# Altium project PowerMonitoringSystem-2.PrjPcb
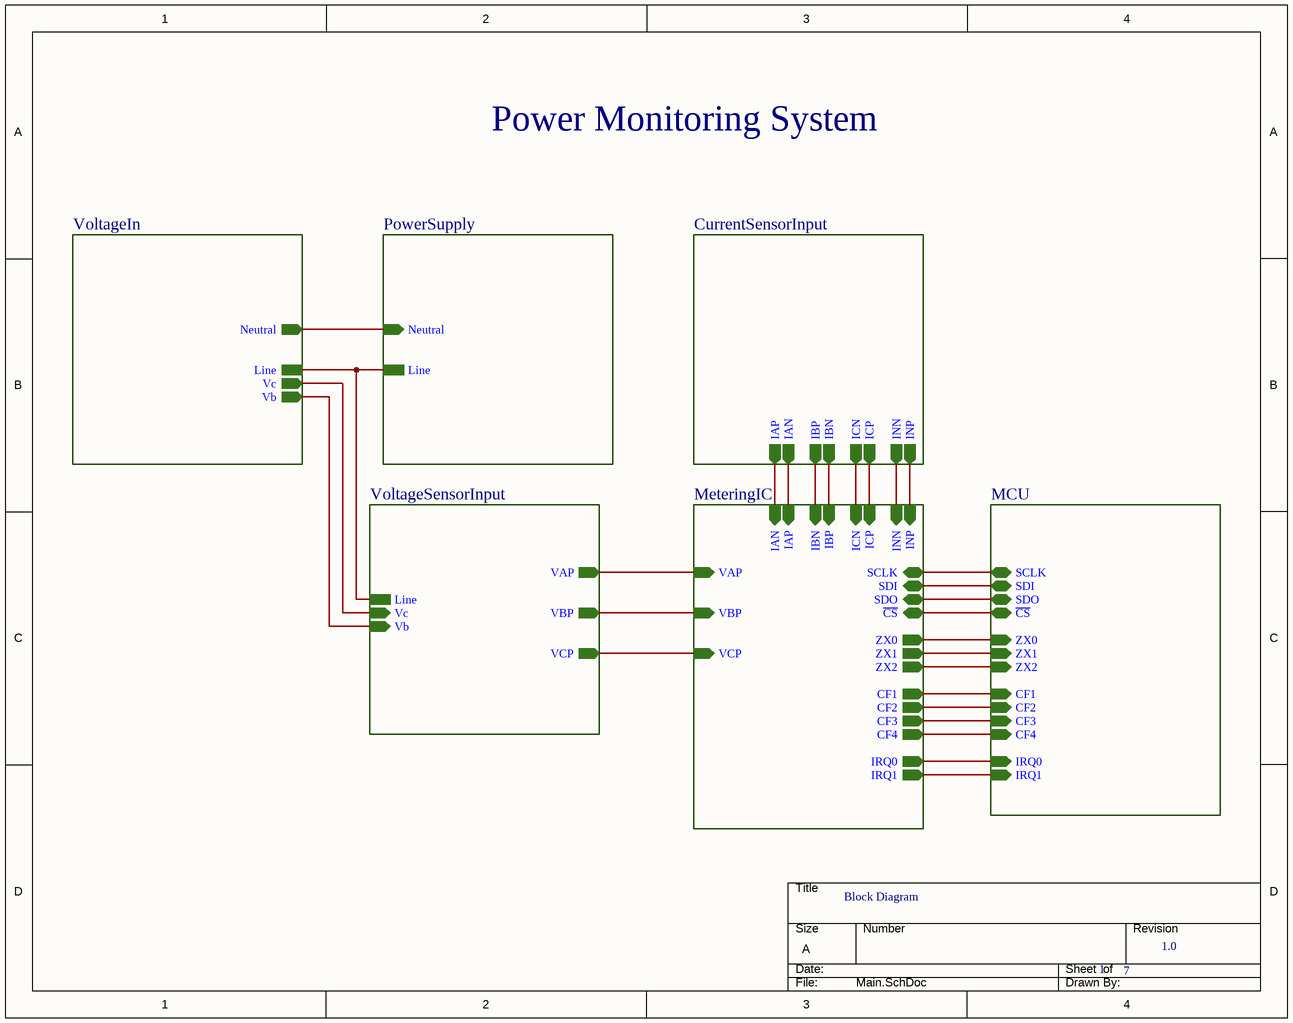
[diagram p0: Main.SchDoc]
7 sheets, 117 parts. Net scope: hierarchical (ports join the sheet entries above them; power ports are global).
Board file: PCB2.PcbDoc
Sheets:
  Main.SchDoc
    VoltageIn = VoltageIn.SchDoc
    PowerSupply = PowerSupply.SchDoc
    CurrentSensorInput = CurrentSensorInput.SchDoc
    MCU = MCU.SchDoc
    VoltageSensorInput = VoltageSensorInput.SchDoc
    MeteringIC = MeteringIC.SchDoc

## Sheet Main.SchDoc
size A; SheetNumber: 1; SheetTotal: 7; ENG_APP_DATE: --/--/--; DSN_APP_DATE: --/--/--; CHK_APP_DATE: --/--/--

### Sub-sheets
CurrentSensorInput = CurrentSensorInput.SchDoc: IAP (out), IAN (out), IBP (out), IBN (out), INP (out), INN (out), ICN (out), ICP (out)
MCU = MCU.SchDoc: SCLK (bidir), SDI (bidir), SDO (bidir), ~{CS} (bidir), ZX0 (in), ZX1 (in), ZX2 (in), CF1 (in), CF2 (in), CF3 (in), CF4 (in), IRQ0 (in), IRQ1 (in)
MeteringIC = MeteringIC.SchDoc: IAN (in), IAP (in), IBN (in), IBP (in), ICN (in), ICP (in), INN (in), INP (in), VAP (in), VBP (in), VCP (in), SDI (bidir), SCLK (bidir), SDO (bidir), ~{CS} (bidir), ZX0 (out), ZX1 (out), ZX2 (out), CF1 (out), CF2 (out), CF3 (out), CF4 (out), IRQ0 (out), IRQ1 (out)
PowerSupply = PowerSupply.SchDoc: Line, Neutral (in)
VoltageIn = VoltageIn.SchDoc: Neutral (out), Line, Vb (out), Vc (out)
VoltageSensorInput = VoltageSensorInput.SchDoc: VAP (out), VBP (out), VCP (out), Line, Vb (in), Vc (in)

### Nets
~{CS}: sheet MCU/~{CS}, sheet MeteringIC/~{CS}
CF1: sheet MCU/CF1, sheet MeteringIC/CF1
CF2: sheet MCU/CF2, sheet MeteringIC/CF2
CF3: sheet MCU/CF3, sheet MeteringIC/CF3
CF4: sheet MCU/CF4, sheet MeteringIC/CF4
IRQ0: sheet MCU/IRQ0, sheet MeteringIC/IRQ0
IRQ1: sheet MCU/IRQ1, sheet MeteringIC/IRQ1
SCLK: sheet MCU/SCLK, sheet MeteringIC/SCLK
SDI: sheet MCU/SDI, sheet MeteringIC/SDI
SDO: sheet MCU/SDO, sheet MeteringIC/SDO
Va: sheet VoltageIn/Line, sheet PowerSupply/Line, sheet VoltageSensorInput/Line
Vb: sheet VoltageIn/Vb, sheet VoltageSensorInput/Vb
Vc: sheet VoltageIn/Vc, sheet VoltageSensorInput/Vc
Vn: sheet VoltageIn/Neutral, sheet PowerSupply/Neutral
ZX0: sheet MCU/ZX0, sheet MeteringIC/ZX0
ZX1: sheet MCU/ZX1, sheet MeteringIC/ZX1
ZX2: sheet MCU/ZX2, sheet MeteringIC/ZX2
NetC11_1: sheet CurrentSensorInput/INN, sheet MeteringIC/INN
NetC12_1: sheet CurrentSensorInput/IBP, sheet MeteringIC/IBN
NetC13_2: sheet CurrentSensorInput/IBN, sheet MeteringIC/IBP
NetC14_2: sheet CurrentSensorInput/INP, sheet MeteringIC/INP
NetC15_1: sheet CurrentSensorInput/ICP, sheet MeteringIC/ICP
NetC16_1: sheet CurrentSensorInput/IAN, sheet MeteringIC/IAP
NetC17_2: sheet CurrentSensorInput/ICN, sheet MeteringIC/ICN
NetC18_2: sheet CurrentSensorInput/IAP, sheet MeteringIC/IAN
NetC19_1: sheet VoltageSensorInput/VAP, sheet MeteringIC/VAP
NetC20_1: sheet VoltageSensorInput/VBP, sheet MeteringIC/VBP
NetC21_1: sheet VoltageSensorInput/VCP, sheet MeteringIC/VCP

### Notes on the sheet
- Power Monitoring System
- Block Diagram
- 1
- 7
- 1.0
- DWG. NO.
- REV.
- SHT.
- THIS DOCUMENT AND THE DATA DISCLOSED HEREIN OR HEREWITH IS THE PROPERTY OF ALTIUM LIMITED AND MAY BE FREELY DISTRIBUTED IN WHOLE. NO RIGHTS ARE RESERVED OR EXPRESS OR IMPLIED WARANTEE GIVEN.
- REVISION
- DESCRIPTION
- DATE
- APPROVED
- ENG:
- APPROVALS
- PROJECT
- DSN:
- CHK:
- REFERENCE DOCUMENTS
- PROJECT REVISION:
- TITLE
- DOCUMENT REVISION:
- DESIGN ITEM:
- BOM:
- FAB DWG:
- PCB DWG:
- ASSY DWG:
- SCALE:
- SIZE
- B
- CAGE CODE
- FILE NAME
- DWG NO.
- SHEET
- OF
- REV

## Sheet VoltageIn.SchDoc
size 199 x 149 mm; SheetNumber: 2; SheetTotal: 7
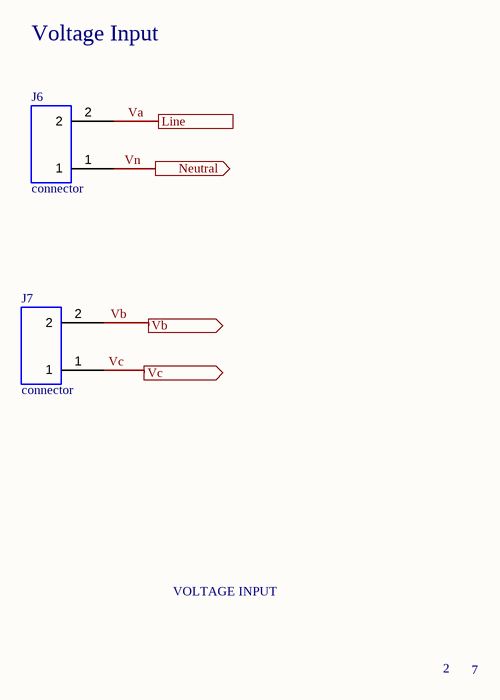
[diagram p1: VoltageIn.SchDoc]

### Parts
J6  connector  [terminal block]
J7  connector  [terminal block]

### Ports
Line (see Main[4C], PowerSupply[4C], VoltageSensorInput[7E]), Neutral (out, see Main[4C], PowerSupply[4C]), Vb (out, see Main[4C], VoltageSensorInput[7D]), Vc (out, see Main[4C], VoltageSensorInput[7B])

### Nets
Va: J6.2 ; port Line
Vb: J7.2 ; port Vb
Vc: J7.1 ; port Vc
Vn: J6.1 ; port Neutral

### Notes on the sheet
- Voltage Input
- VOLTAGE INPUT
- 2
- 7
- DWG. NO.
- REV.
- SHT.
- THIS DOCUMENT AND THE DATA DISCLOSED HEREIN OR HEREWITH IS THE PROPERTY OF ALTIUM LIMITED AND MAY BE FREELY DISTRIBUTED IN WHOLE. NO RIGHTS ARE RESERVED OR EXPRESS OR IMPLIED WARANTEE GIVEN.
- REVISION
- DESCRIPTION
- DATE
- APPROVED
- ENG:
- APPROVALS
- PROJECT
- DSN:
- CHK:
- REFERENCE DOCUMENTS
- PROJECT REVISION:
- TITLE
- DOCUMENT REVISION:
- DESIGN ITEM:
- BOM:
- FAB DWG:
- PCB DWG:
- ASSY DWG:
- SCALE:
- SIZE
- B
- CAGE CODE
- FILE NAME
- DWG NO.
- SHEET
- OF
- REV

## Sheet PowerSupply.SchDoc: Power Supply Unit
size A; SheetNumber: 3; SheetTotal: 7
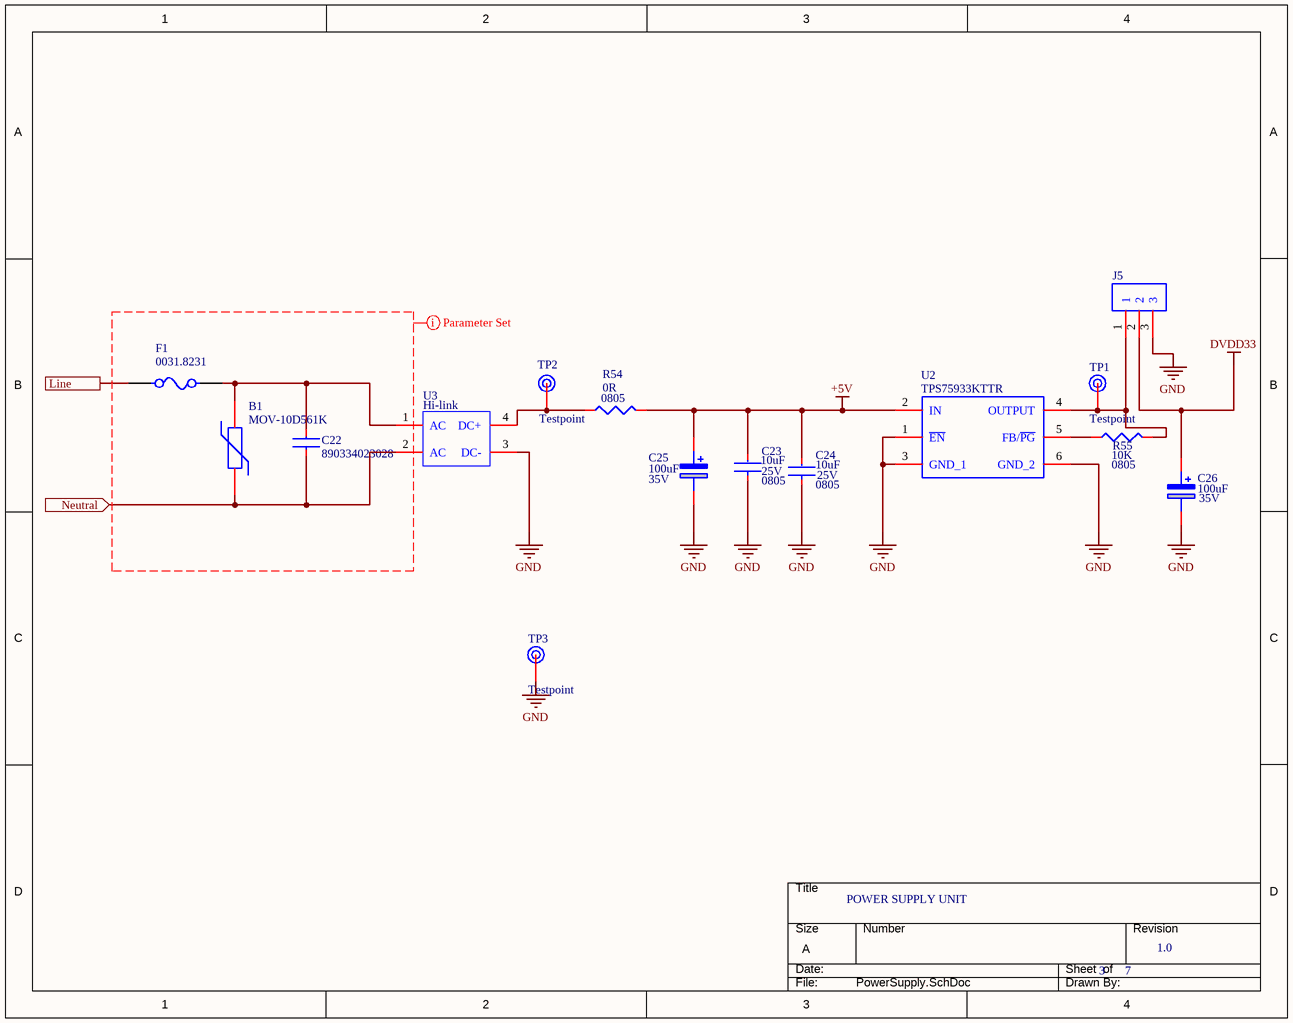
[diagram p2: PowerSupply.SchDoc]

### Parts
B1  MOV-10D561K  [MOV10D561K]
C22  890334023028  [890334023028]
C23  Capacitance: 10uF  Voltage: 25V  Size: 0805  [FP-GRM21B-0_2-e0_2_0_7-IPC_B]  (hidden comment: GRM21BC71E106KE01L)
C24  Capacitance: 10uF  Voltage: 25V  Size: 0805  [FP-GRM21B-0_2-e0_2_0_7-IPC_B]  (hidden comment: GRM21BC71E106KE01L)
C25  Capacitance: 100uF  Voltage: 35V  [CAPPRD250W50D630H1250]  (hidden comment: ESC107M035AE3AA)
C26  Capacitance: 100uF  Voltage: 35V  [CAPPRD250W50D630H1250]  (hidden comment: ESC107M035AE3AA)
F1  0031.8231  [FP-0031_8231-MFG]
J5  HTSW-103-07-G-S  [HDRV3W64P0X254_1X3_749X249X858P]  (value not drawn)
R54  Resistance: 0R  Size: 0805  [RESC2013X84N]  (hidden comment: WSL080500000ZEA9)
R55  Resistance: 10K  Size: 0805  [RESC2013X84N]  (hidden comment: CRCW201010K0JNEFIF)
TP1  Testpoint  [Testpad]
TP2  Testpoint  [Testpad]
TP3  Testpoint  [Testpad]
U2  TPS75933KTTR  [TPS75933KTTR]
U3  Hi-link  [Hi-Link]

### Ports
Line (see Main[3C], VoltageIn[4E], VoltageSensorInput[7E]), Neutral (in, see Main[3C], VoltageIn[4D])

### Nets
+5V: C23.2 C24.2 C25.1(+) R54.1 U2.2(IN)
DVDD33: C26.1(+) J5.2  [project net AVDD33]
GND: C23.1 C24.1 C25.2(-) C26.2(-) J5.3 TP3.1 U2.1(~{EN}) U2.3(GND_1) U2.6(GND_2) U3.3(DC-)
Va: F1.1 ; port Line
Vn: B1.1 C22.1 U3.2(AC) ; port Neutral
NetB1_2: B1.2 C22.2 F1.2 U3.1(AC)
NetJ5_1: J5.1 R55.1 TP1.1 U2.4(OUTPUT)
NetR54_2: R54.2 TP2.1 U3.4(DC+)
NetR55_2: R55.2 U2.5(FB/~{PG})

### Layout directives
net class AC_Nets: (no net found under the mark)

### Notes on the sheet
- POWER SUPPLY UNIT
- 3
- 7
- 1.0

### Library data of the parts
B1 = MOV-10D561K: Varistors 180pF 560volts 10%; Manufacturer_Name: Bourns; Geometry.Height: 15.5mm; Mouser Part Number: 652-MOV-10D561K; Mouser Price/Stock: https://www.mouser.co.uk/ProductDetail/Bourns/MOV-10D561K?qs=lgttKnAd%252B2ArrqGQgWwr6w%3D%3D; Manufacturer_Part_Number: MOV-10D561K; Datasheet Link: https://www.bourns.com/docs/Product-Datasheets/MOV10D.pdf
C22 = 890334023028: WURTH ELEKTRONIK - 890334023028 - Safety Capacitor, 0.22 F, X2, WCAP-FTXX Series, 310 V, Metallized PP; Geometry.Height: 14.5mm; Mouser Part Number: 710-890334023028; Mouser Price/Stock: https://www.mouser.co.uk/ProductDetail/Wurth-Elektronik/890334023028?qs=pceeu5JH%2FH%2FQtsmowFDNJg%3D%3D; Manufacturer_Name: Wurth Elektronik; Manufacturer_Part_Number: 890334023028; Datasheet Link: *
C23 C24 = CMP-06035-063441-1: Chip Multilayer Ceramic Capacitors for General Purpose, 10μF ±10%, X7S(EIA), ±22.0%, 25Vdc, 0805 (2012M)
C25 C26 = ESC107M035AE3AA: ESC, Aluminum, Aluminum Electrolytic, 100 uF, 20%, 35 VDC, -40/+105C, 105C, -40C, 105C, 2,000 Hrs, 12 % , 180 mOhms, 35 uA, 3, 4, 6.3mm, 11mm, Lead Spacing = 2.5mm, 20mm, 10000; Manufacturer_Name: KEMET; Geometry.Height: 12.5mm; Mouser Part Number: 80-ESC107M035AE3AA; Mouser Price/Stock: https://www.mouser.co.uk/ProductDetail/KEMET/ESC107M035AE3AA?qs=F5EMLAvA7IA7q%2FLtm4zOMg%3D%3D; Manufacturer_Part_Number: ESC107M035AE3AA; Datasheet Link: https://content.kemet.com/datasheets/KEM_A4006_ESC.pdf
F1 = CMP-26292-000005-1: FUSE BLOK CARTRIDGE 600V 16A PCB; Manufacturer: Schurter; Voltage Rating Ac: 500V; Number Of Fuses: 1; Standoff Height: 0.7mm; Conn Orientation: Horizontal; ComponentLink2URL: https://www.schurter.com/en/datasheet/typ_OGD.pdf; Voltage Rating Dc: 600V; Package: 0; Device Class L3: unset; Digikey Description: FUSE BLOK CARTRIDGE 600V 16A PCB; Mouser Description: Fuse Holder OGD FUSEHOLDER 5X20/6.3X32; Category: Fuse; Device Class L2: Fuse Holders; Height: 12.7mm; ComponentLink2Description: Datasheet; Ambient Temperature Range Low: -40°C; Ambient Temperature Range High: +85°C; Octopart: https://octopart.com/0031.8231-schurter-8659; Automotive: No; RoHS: TRUE; Fuse Current: 16A; Lead Free: Yes; Device Class L1: Circuit Protection; Manufacturer Part Number: 0031.8231
J5 = HTSW-103-07-G-S: Samtec HTSW, 2.54mm Pitch, 3 Way, 1 Row, Vertical Pin Header, Through Hole; Geometry.Height: 8.58mm; Mouser Part Number: 200-HTSW10307GS; Mouser Price/Stock: https://www.mouser.co.uk/ProductDetail/Samtec/HTSW-103-07-G-S?qs=0lQeLiL1qyYZ%252B%2F6nDbu9tg%3D%3D; Manufacturer_Name: SAMTEC; Manufacturer_Part_Number: HTSW-103-07-G-S; Datasheet Link: http://suddendocs.samtec.com/prints/htsw-xxx-xx-xxx-x-xx-xx-xx-mkt.pdf
R54 = WSL080500000ZEA9: VISHAY - WSL080500000ZEA9 - SMD Chip Resistor, Jumper, 0805 [2012 Metric], 0 ohm, WSL-9 Series, Metal Strip; Geometry.Height: 0.838mm; Mouser Part Number: 71-WSL080500000ZEA9; Mouser Price/Stock: https://www.mouser.co.uk/ProductDetail/Vishay-Dale/WSL080500000ZEA9?qs=f1l5vAGoKgsImKS87N8TmQ%3D%3D; Manufacturer_Name: Vishay; Manufacturer_Part_Number: WSL080500000ZEA9; Datasheet Link: https://ad.componentsearchengine.com/Datasheets/2/WSL080500000ZEA9.pdf
R55 = WSL080500000ZEA9: VISHAY - CRCW201010K0JNEFIF - SMD Chip Resistor, Jumper, 0805 [2012 Metric], 10k, WSL-9 Series, Metal Strip; Geometry.Height: 0.838mm; Mouser Part Number: 71-WSL080500000ZEA9; Mouser Price/Stock: https://www.mouser.co.uk/ProductDetail/Vishay-Dale/WSL080500000ZEA9?qs=f1l5vAGoKgsImKS87N8TmQ%3D%3D; Manufacturer_Name: Vishay; Manufacturer_Part_Number: WSL080500000ZEA9; Datasheet Link: https://ad.componentsearchengine.com/Datasheets/2/WSL080500000ZEA9.pdf
U2 = TPS75933KTTR: Fast-Transient Response, 7.5-A, Low-Dropout Voltage Regulators with Power Good; Manufacturer_Name: Texas Instruments; Geometry.Height: 4.83mm; Mouser Part Number: 595-TPS75933KTTR; Mouser Price/Stock: https://www.mouser.co.uk/ProductDetail/Texas-Instruments/TPS75933KTTR?qs=6zVL%252ByCp0mrrB34Pfenz6g%3D%3D; Manufacturer_Part_Number: TPS75933KTTR; Datasheet Link: http://www.ti.com/lit/gpn/tps759
U3 = Hi-link: Hi-Link HLK-20M05 220VAC to 5VDC 20W Step-Down Power Supply Module

## Sheet CurrentSensorInput.SchDoc
size 250 x 199 mm; SheetNumber: 5; SheetTotal: 7; Voltage: 16; ENG_APP_DATE: --/--/--; DSN_APP_DATE: --/--/--; CHK_APP_DATE: --/--/--
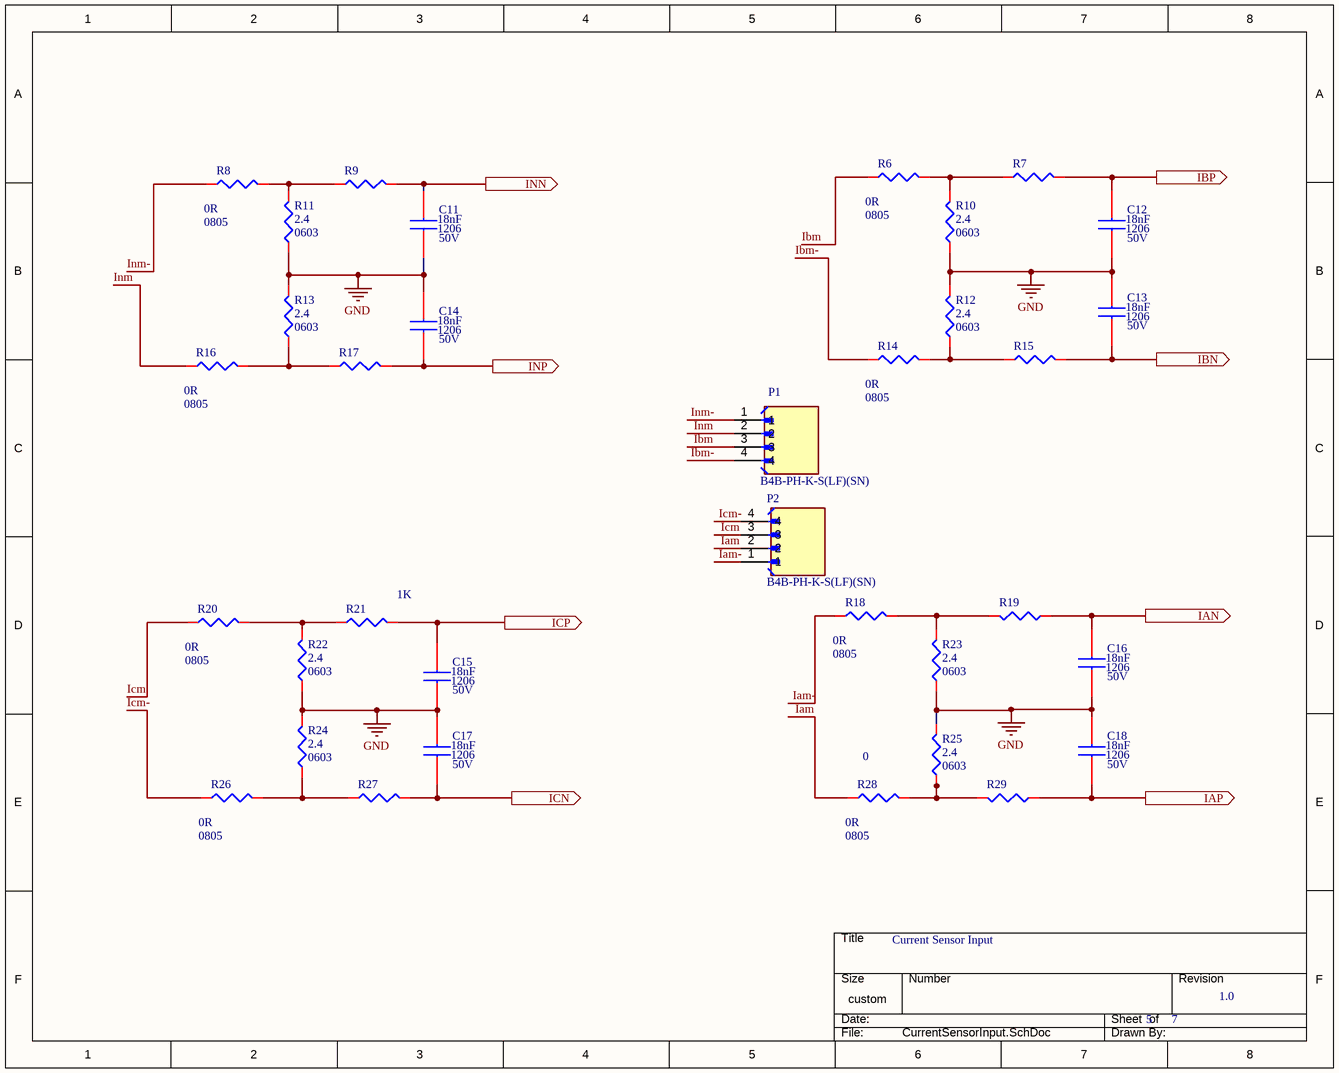
[diagram p3: CurrentSensorInput.SchDoc]

### Parts
C11  Size: 1206  Capacitance: 18nF  Voltage: 50V  [CAPC3316X180N]  (hidden comment: C1206C183J5RACTU)
C12  Size: 1206  Capacitance: 18nF  Voltage: 50V  [CAPC3316X180N]  (hidden comment: C1206C183J5RACTU)
C13  Size: 1206  Capacitance: 18nF  Voltage: 50V  [CAPC3316X180N]  (hidden comment: C1206C183J5RACTU)
C14  Size: 1206  Capacitance: 18nF  Voltage: 50V  [CAPC3316X180N]  (hidden comment: C1206C183J5RACTU)
C15  Size: 1206  Capacitance: 18nF  Voltage: 50V  [CAPC3316X180N]  (hidden comment: C1206C183J5RACTU)
C16  Size: 1206  Capacitance: 18nF  Voltage: 50V  [CAPC3316X180N]  (hidden comment: C1206C183J5RACTU)
C17  Size: 1206  Capacitance: 18nF  Voltage: 50V  [CAPC3316X180N]  (hidden comment: C1206C183J5RACTU)
C18  Size: 1206  Capacitance: 18nF  Voltage: 50V  [CAPC3316X180N]  (hidden comment: C1206C183J5RACTU)
P1  B4B-PH-K-S(LF)(SN)  [JST_B4B-PH-K-S(LF)(SN)]
P2  B4B-PH-K-S(LF)(SN)  [JST_B4B-PH-K-S(LF)(SN)]
R6  Resistance: 0R  Size: 0805  [RESC2013X84N]  (hidden comment: WSL080500000ZEA9)
R7  ERA-6AED102V  [RESC2013X84N]  (value not drawn)
R8  Resistance: 0R  Size: 0805  [RESC2013X84N]  (hidden comment: WSL080500000ZEA9)
R9  ERA-6AED102V  [RESC2013X84N]  (value not drawn)
R10  Resistance: 2.4  Size: 0603  [RESC1608X55N]  (hidden comment: CPF-A-0603B2K4E1)
R11  Resistance: 2.4  Size: 0603  [RESC1608X55N]  (hidden comment: CPF-A-0603B2K4E1)
R12  Resistance: 2.4  Size: 0603  [RESC1608X55N]  (hidden comment: CPF-A-0603B2K4E1)
R13  Resistance: 2.4  Size: 0603  [RESC1608X55N]  (hidden comment: CPF-A-0603B2K4E1)
R14  Resistance: 0R  Size: 0805  [RESC2013X84N]  (hidden comment: WSL080500000ZEA9)
R15  ERA-6AED102V  [RESC2013X84N]  (value not drawn)
R16  Resistance: 0R  Size: 0805  [RESC2013X84N]  (hidden comment: WSL080500000ZEA9)
R17  ERA-6AED102V  [RESC2013X84N]  (value not drawn)
R18  Resistance: 0R  Size: 0805  [RESC2013X84N]  (hidden comment: WSL080500000ZEA9)
R19  ERA-6AED102V  [RESC2013X84N]  (value not drawn)
R20  Resistance: 0R  Size: 0805  [RESC2013X84N]  (hidden comment: WSL080500000ZEA9)
R21  ERA-6AED102V  [RESC2013X84N]  (value not drawn)
R22  Resistance: 2.4  Size: 0603  [RESC1608X55N]  (hidden comment: CPF-A-0603B2K4E1)
R23  Resistance: 2.4  Size: 0603  [RESC1608X55N]  (hidden comment: CPF-A-0603B2K4E1)
R24  Resistance: 2.4  Size: 0603  [RESC1608X55N]  (hidden comment: CPF-A-0603B2K4E1)
R25  Resistance: 2.4  Size: 0603  [RESC1608X55N]  (hidden comment: CPF-A-0603B2K4E1)
R26  Resistance: 0R  Size: 0805  [RESC2013X84N]  (hidden comment: WSL080500000ZEA9)
R27  ERA-6AED102V  [RESC2013X84N]  (value not drawn)
R28  Resistance: 0R  Size: 0805  [RESC2013X84N]  (hidden comment: WSL080500000ZEA9)
R29  ERA-6AED102V  [RESC2013X84N]  (value not drawn)

### Ports
IAN (out, see Main[2C]), IAP (out, see Main[2C]), IBN (out, see Main[2C]), IBP (out, see Main[2C]), ICN (out, see Main[2C], MeteringIC[5D]), ICP (out, see Main[2C], MeteringIC[5D]), INN (out, see Main[2C], MeteringIC[5D]), INP (out, see Main[2C], MeteringIC[5D])

### Nets
GND: C11.2 C12.2 C13.1 C14.1 C15.2 C16.2 C17.1 C18.1 R10.2 R11.2 R12.1 R13.1 R22.2 R23.2 R24.1 R25.1
Iam: P2.2 R28.2
Iam-: P2.1 R18.2
Ibm: P1.3 R6.2
Ibm-: P1.4 R14.2
Icm: P2.3 R20.2
Icm-: P2.4 R26.2
Inm: P1.2 R16.2
Inm-: P1.1 R8.2
NetC11_1: C11.1 R9.1 ; port INN
NetC12_1: C12.1 R7.1 ; port IBP
NetC13_2: C13.2 R15.1 ; port IBN
NetC14_2: C14.2 R17.1 ; port INP
NetC15_1: C15.1 R21.1 ; port ICP
NetC16_1: C16.1 R19.2 ; port IAN
NetC17_2: C17.2 R27.1 ; port ICN
NetC18_2: C18.2 R29.2 ; port IAP
NetR6_1: R6.1 R7.2 R10.1
NetR8_1: R8.1 R9.2 R11.1
NetR12_2: R12.2 R14.1 R15.2
NetR13_2: R13.2 R16.1 R17.2
NetR18_1: R18.1 R19.1 R23.1
NetR20_1: R20.1 R21.2 R22.1
NetR24_2: R24.2 R26.1 R27.2
NetR25_2: R25.2 R28.1 R29.1

### Notes on the sheet
- (near R21) 1K
- (near R28) 0
- Current Sensor Input
- 5
- 7
- 1.0
- DWG. NO.
- REV.
- SHT.
- THIS DOCUMENT AND THE DATA DISCLOSED HEREIN OR HEREWITH IS THE PROPERTY OF ALTIUM LIMITED AND MAY BE FREELY DISTRIBUTED IN WHOLE. NO RIGHTS ARE RESERVED OR EXPRESS OR IMPLIED WARANTEE GIVEN.
- REVISION
- DESCRIPTION
- DATE
- APPROVED
- ENG:
- APPROVALS
- PROJECT
- DSN:
- CHK:
- REFERENCE DOCUMENTS
- PROJECT REVISION:
- TITLE
- DOCUMENT REVISION:
- DESIGN ITEM:
- BOM:
- FAB DWG:
- PCB DWG:
- ASSY DWG:
- SCALE:
- SIZE
- B
- CAGE CODE
- FILE NAME
- DWG NO.
- SHEET
- OF
- REV

### Library data of the parts
C11-C18 = C1206X224KARACAUTO: Multilayer Ceramic Capacitors MLCC - SMD/SMT 50V 0.018uF X7R 1206 5%; Manufacturer_Name: KEMET; Geometry.Height: 1.8mm; Mouser Part Number: 80-C1206X224KARAUTO; Mouser Price/Stock: https://www.mouser.co.uk/ProductDetail/KEMET/C1206X224KARACAUTO?qs=zW32dvEIR3ul9TqTUrs40g%3D%3D; Manufacturer_Part_Number: C1206X224KARACAUTO; Datasheet Link: https://search.kemet.com/component-documentation/download/specsheet/C1206X224KARACAUTO
P1 P2 = CMP-002-00071-1: Connector Header Through Hole 4 position 0.079 (2.00mm); MF: JST; Design Item ID: B4B-PH-K-S(LF)(SN); MP: B4B-PH-K-S(LF)(SN); Pins: 4; SnapEDA_Link: https://www.snapeda.com/parts/B4B-PH-K-S(LF)(SN)/JST/view-part/?ref=snap; Check_prices: https://www.snapeda.com/parts/B4B-PH-K-S(LF)(SN)/JST/view-part/?ref=eda; Component Type: Standard; Case/Package: None; Value: *; Source: B4B-PH-K-S(LF)(SN).SchLib
R6 R8 R14 R16 R18 R20 R26 R28 = WSL080500000ZEA9: as R54 on sheet PowerSupply; Mouser Part Number: 71-WSL080500000ZEA9; Mouser Price/Stock: https://www.mouser.co.uk/ProductDetail/Vishay-Dale/WSL080500000ZEA9?qs=f1l5vAGoKgsImKS87N8TmQ%3D%3D; Manufacturer_Name: Vishay; Manufacturer_Part_Number: WSL080500000ZEA9; Datasheet Link: https://ad.componentsearchengine.com/Datasheets/2/WSL080500000ZEA9.pdf
R7 R9 R15 R17 R19 R21 R27 R29 = ERA-6AED102V: Thin Film Resistors - SMD 0805 1000ohms 25ppm 0.5% AEC-Q200; Manufacturer_Name: Panasonic; Geometry.Height: 0.6mm; Mouser Part Number: 667-ERA-6AED102V; Mouser Price/Stock: https://www.mouser.co.uk/ProductDetail/Panasonic/ERA-6AED102V?qs=MNPzkKEzRtTAvKH%252BuMqwyg%3D%3D; Manufacturer_Part_Number: ERA-6AED102V; Datasheet Link: https://industrial.panasonic.com/cdbs/www-data/pdf/RDM0000/AOA0000C307.pdf
R10-R13 R22-R25 = WSL080500000ZEA9: Thick Film Resistors - SMD 2.4OHM 1% 1/2W 100PPM; Manufacturer_Name: Vishay; Geometry.Height: 0.838mm; Mouser Part Number: 71-WSL080500000ZEA9; Mouser Price/Stock: https://www.mouser.co.uk/ProductDetail/Vishay-Dale/WSL080500000ZEA9?qs=f1l5vAGoKgsImKS87N8TmQ%3D%3D; Manufacturer_Part_Number: WSL080500000ZEA9; Datasheet Link: https://ad.componentsearchengine.com/Datasheets/2/WSL080500000ZEA9.pdf

## Sheet MCU.SchDoc
size 250 x 219 mm; SheetNumber: 7; SheetTotal: 7; ENG_APP_DATE: --/--/--; DSN_APP_DATE: --/--/--; CHK_APP_DATE: --/--/--
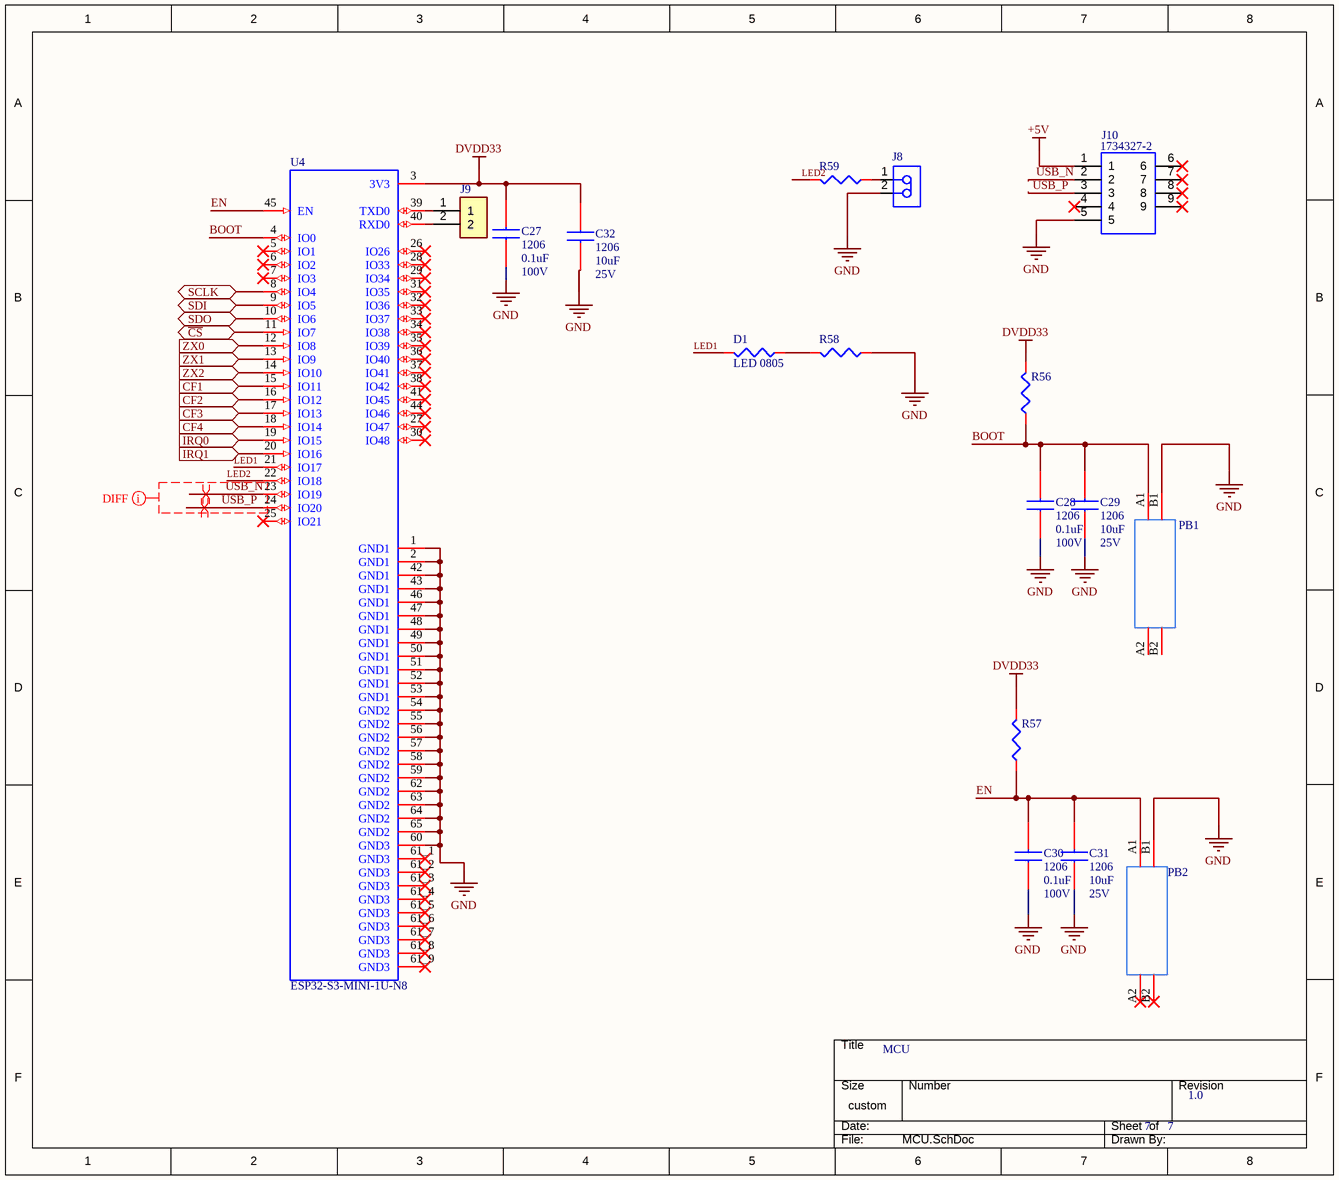
[diagram p4: MCU.SchDoc]

### Parts
C27  Size: 1206  Capacitance: 0.1uF  Voltage: 100V  [CAPC3316X180N]  (hidden comment: C1206C104J1RACAUTO)
C28  Size: 1206  Capacitance: 0.1uF  Voltage: 100V  [CAPC3316X180N]  (hidden comment: C1206C104J1RACAUTO)
C29  Size: 1206  Capacitance: 10uF  Voltage: 25V  [CAPC3316X180N]  (hidden comment: MBAST31LAB7106KTNA01)
C30  Size: 1206  Capacitance: 0.1uF  Voltage: 100V  [CAPC3316X180N]  (hidden comment: C1206C104J1RACAUTO)
C31  Size: 1206  Capacitance: 10uF  Voltage: 25V  [CAPC3316X180N]  (hidden comment: MBAST31LAB7106KTNA01)
C32  Size: 1206  Capacitance: 10uF  Voltage: 25V  [CAPC3316X180N]  (hidden comment: MBAST31LAB7106KTNA01)
D1  LED 0805  [RESC2013X84N]
J8  B2B-PH-K-S(LF)(SN)  [JST-B2B-PH-K-S_V]  (value not drawn)
J9  HTSW-102-07-G-S  [HDRV2W64P0X254_1X2_508X248X838P]  (value not drawn)
J10  1734327-2  [17343272]
PB1  EVP-BV2C3L000  [EVPBV2C3L000]  (value not drawn)
PB2  EVP-BV2C3L000  [EVPBV2C3L000]  (value not drawn)
R56  ERA-6AED102V  [RESC2013X84N]  (value not drawn)
R57  ERA-6AED102V  [RESC2013X84N]  (value not drawn)
R58  ERA-6AED102V  [RESC2013X84N]  (value not drawn)
R59  ERA-6AED102V  [RESC2013X84N]  (value not drawn)
U4  ESP32-S3-MINI-1U-N8  [XCVR_ESP32-S3-MINI-1U-N8]

### Ports
CF1 (in, see Main[1B], MeteringIC[1D]), CF2 (in, see Main[1B], MeteringIC[2C]), CF3 (in, see Main[1B], MeteringIC[2C]), CF4 (in, see Main[1B], MeteringIC[2C]), IRQ0 (in, see Main[1B], MeteringIC[2C]), IRQ1 (in, see Main[1A], MeteringIC[2C]), SCLK (bidir, see Main[1B], MeteringIC[2E]), SDI (bidir, see Main[1B], MeteringIC[2E]), SDO (bidir, see Main[1B], MeteringIC[2E]), ZX0 (in, see Main[1B], MeteringIC[2D]), ZX1 (in, see Main[1B], MeteringIC[2D]), ZX2 (in, see Main[1B], MeteringIC[2D]), ~{CS} (bidir, see Main[1B], MeteringIC[2E])

### Nets
+5V: J10.1
DVDD33: C27.1 C32.1 R56.1 R57.1 U4.3(3V3)  [project net AVDD33]
GND: C27.2 C28.2 C29.2 C30.2 C31.2 C32.2 J8.2 J10.5 PB1.B1(NO_1) PB2.B1(NO_1) R58.2 U4.1(GND1) U4.2(GND1) U4.42(GND1) U4.43(GND1) U4.46(GND1) U4.47(GND1) U4.48(GND1) U4.49(GND1) U4.50(GND1) U4.51(GND1) U4.52(GND1) U4.53(GND1) U4.54(GND2) U4.55(GND2) U4.56(GND2) U4.57(GND2) U4.58(GND2) U4.59(GND2) U4.60(GND3) U4.62(GND2) U4.63(GND2) U4.64(GND2) U4.65(GND2)
BOOT: C28.1 C29.1 PB1.A1(COM_1) R56.2 U4.4(IO0)
~{CS}: U4.11(IO7) ; port ~{CS}
CF1: U4.15(IO11) ; port CF1
CF2: U4.16(IO12) ; port CF2
CF3: U4.17(IO13) ; port CF3
CF4: U4.18(IO14) ; port CF4
EN: C30.1 C31.1 PB2.A1(COM_1) R57.2 U4.45(EN)
IRQ0: U4.19(IO15) ; port IRQ0
IRQ1: U4.20(IO16) ; port IRQ1
LED1: D1.1 U4.21(IO17)
LED2: R59.2 U4.22(IO18)
SCLK: U4.8(IO4) ; port SCLK
SDI: U4.9(IO5) ; port SDI
SDO: U4.10(IO6) ; port SDO
USB_N: J10.2 U4.23(IO19)
USB_P: J10.3 U4.24(IO20)
ZX0: U4.12(IO8) ; port ZX0
ZX1: U4.13(IO9) ; port ZX1
ZX2: U4.14(IO10) ; port ZX2
NetD1_2: D1.2 R58.1
NetJ8_1: J8.1 R59.1
NetJ9_1: J9.1 U4.39(TXD0)
NetJ9_2: J9.2 U4.40(RXD0)

Not connected (* = marked no-connect by the designer): J10 4* 6* 7* 8* 9*; PB1 A2(COM_2) B2(NO_2); PB2 A2(COM_2)* B2(NO_2)*; U4 5(IO1)* 6(IO2)* 7(IO3)* 25(IO21)* 26(IO26)* 27(IO47)* 28(IO33)* 29(IO34)* 30(IO48)* 31(IO35)* 32(IO36)* 33(IO37)* 34(IO38)* 35(IO39)* 36(IO40)* 37(IO41)* 38(IO42)* 41(IO45)* 44(IO46)* 61_1(GND3)* 61_2(GND3)* 61_3(GND3)* 61_4(GND3)* 61_5(GND3)* 61_6(GND3)* 61_7(GND3)* 61_8(GND3)* 61_9(GND3)*

### Layout directives
differential pair: USB_N, USB_P
net class DIFF: USB_N, USB_P

### Notes on the sheet
- MCU
- 7
- 1.0
- DWG. NO.
- REV.
- SHT.
- THIS DOCUMENT AND THE DATA DISCLOSED HEREIN OR HEREWITH IS THE PROPERTY OF ALTIUM LIMITED AND MAY BE FREELY DISTRIBUTED IN WHOLE. NO RIGHTS ARE RESERVED OR EXPRESS OR IMPLIED WARANTEE GIVEN.
- REVISION
- DESCRIPTION
- DATE
- APPROVED
- ENG:
- APPROVALS
- PROJECT
- DSN:
- CHK:
- REFERENCE DOCUMENTS
- PROJECT REVISION:
- TITLE
- DOCUMENT REVISION:
- DESIGN ITEM:
- BOM:
- FAB DWG:
- PCB DWG:
- ASSY DWG:
- SCALE:
- SIZE
- B
- CAGE CODE
- FILE NAME
- DWG NO.
- SHEET
- OF
- REV

### Library data of the parts
C27 C28 C30 = C1206X224KARACAUTO: Multilayer Ceramic Capacitors MLCC - SMD/SMT 100V 0.1uF X7R 1206 5% AEC-Q200; Manufacturer_Name: KEMET; Geometry.Height: 1.8mm; Mouser Part Number: 80-C1206X224KARAUTO; Mouser Price/Stock: https://www.mouser.co.uk/ProductDetail/KEMET/C1206X224KARACAUTO?qs=zW32dvEIR3ul9TqTUrs40g%3D%3D; Manufacturer_Part_Number: C1206X224KARACAUTO; Datasheet Link: https://search.kemet.com/component-documentation/download/specsheet/C1206X224KARACAUTO
C29 C31 C32 = C1206X224KARACAUTO: Multilayer Ceramic Capacitors MLCC - SMD/SMT 25V 10uF X7R 1206 10%; Manufacturer_Name: KEMET; Geometry.Height: 1.8mm; Mouser Part Number: 80-C1206X224KARAUTO; Mouser Price/Stock: https://www.mouser.co.uk/ProductDetail/KEMET/C1206X224KARACAUTO?qs=zW32dvEIR3ul9TqTUrs40g%3D%3D; Manufacturer_Part_Number: C1206X224KARACAUTO; Datasheet Link: https://search.kemet.com/component-documentation/download/specsheet/C1206X224KARACAUTO
D1 R56 R57 = ERA-6AED102V: as R7 on sheet CurrentSensorInput; Datasheet Link: https://industrial.panasonic.com/cdbs/www-data/pdf/RDM0000/AOA0000C307.pdf; Manufacturer_Part_Number: ERA-6AED102V; Mouser Part Number: 667-ERA-6AED102V; Mouser Price/Stock: https://www.mouser.co.uk/ProductDetail/Panasonic/ERA-6AED102V?qs=MNPzkKEzRtTAvKH%252BuMqwyg%3D%3D
J8 = CMP-2000-05162-1: Male Header, Pitch 2 mm, 1 x 2 Position, Height 6 mm, Tail Length 3.4 mm, -25 to 85 degC, RoHS, Bulk; Manufacturer: JST; Pitch: 2mm; Style/Orientation: StraightHeader/Plug; No of Positions: 2; Datasheet Version: Nov-08; Datasheet URL: http://datasheet.octopart.com/B2B-PH-K-S%28LF%29%28SN%29-JST-datasheet-8324864.pdf; Manufacturer URL: http://www.jst.com/home2.html; Type: ShroudedHeader; Termination: Crimp
J9 = HTSW-102-07-G-S: Samtec, HTSW, 2 Way, 1 Row, Vertical Pin Header; Geometry.Height: 8.38mm; Mouser Part Number: 200-HTSW10207GS; Mouser Price/Stock: https://www.mouser.co.uk/ProductDetail/Samtec/HTSW-102-07-G-S?qs=FESYatJ8odI1BCBanfu%2FIg%3D%3D; Manufacturer_Name: SAMTEC; Manufacturer_Part_Number: HTSW-102-07-G-S; Datasheet Link: http://suddendocs.samtec.com/prints/htsw-xxx-xx-xxx-x-xx-xx-xx-mkt.pdf
J10 = 1734327-2: Body Features: Offset 0 MM; Manufacturer_Name: TE Connectivity; Geometry.Height: 4.14mm; Mouser Part Number: 571-1734327-2; Mouser Price/Stock: https://www.mouser.co.uk/ProductDetail/TE-Connectivity/1734327-2?qs=MP5IOa7hLjVR6N4sgEE7xA%3D%3D; Manufacturer_Part_Number: 1734327-2; Datasheet Link: https://www.te.com/commerce/DocumentDelivery/DDEController?Action=srchrtrv&DocNm=1734327&DocType=Customer+Drawing&DocLang=English&DocFormat=pdf&PartCntxt=1734327-2
PB1 PB2 = EVP-BV2C3L000: Tactile Switches 6.5mm 6.2mm SMD Op Force 1.6N; Manufacturer_Name: Panasonic; Geometry.Height: 4.5mm; Mouser Part Number: 667-EVP-BV2C3L000; Mouser Price/Stock: https://www.mouser.co.uk/ProductDetail/Panasonic/EVP-BV2C3L000?qs=MyNHzdoqoQLjk3IN4ali%252Bg%3D%3D; Manufacturer_Part_Number: EVP-BV2C3L000; Datasheet Link: https://media.digikey.com/pdf/Data%20Sheets/Panasonic%20Electronic%20Components/EVP-BV_Type_DS.pdf
R58 = ERA-6AED102V: Thin Film Resistors - SMD 0805 330ohms 25ppm 0.5% AEC-Q200; Manufacturer_Name: Panasonic; Geometry.Height: 0.6mm; Datasheet Link: https://industrial.panasonic.com/cdbs/www-data/pdf/RDM0000/AOA0000C307.pdf; Manufacturer_Part_Number: ERA-6AED102V; Mouser Part Number: 667-ERA-6AED102V; Mouser Price/Stock: https://www.mouser.co.uk/ProductDetail/Panasonic/ERA-6AED102V?qs=MNPzkKEzRtTAvKH%252BuMqwyg%3D%3D
R59 = ERA-6AED102V: 0805 330R; Manufacturer_Name: Panasonic; Geometry.Height: 0.6mm; Datasheet Link: https://industrial.panasonic.com/cdbs/www-data/pdf/RDM0000/AOA0000C307.pdf; Manufacturer_Part_Number: ERA-6AED102V; Mouser Part Number: 667-ERA-6AED102V; Mouser Price/Stock: https://www.mouser.co.uk/ProductDetail/Panasonic/ERA-6AED102V?qs=MNPzkKEzRtTAvKH%252BuMqwyg%3D%3D
U4 = ESP32-S3-MINI-1U-N8: Bluetooth, WiFi 802.11b/g/n, Bluetooth v5.0 Transceiver Module 2.4GHz Antenna Not Included, U.FL Surface Mount; MF: Espressif Systems; SnapEDA_Link: https://www.snapeda.com/parts/ESP32-S3-MINI-1U-N8/Espressif+Systems/view-part/?ref=snap; Package: VFQFN-56 Espressif Systems; Value: *; MP: ESP32-S3-MINI-1U-N8; Check_prices: https://www.snapeda.com/parts/ESP32-S3-MINI-1U-N8/Espressif+Systems/view-part/?ref=eda

## Sheet VoltageSensorInput.SchDoc
size 219 x 180 mm; SheetNumber: 6; SheetTotal: 7; ENG_APP_DATE: --/--/--; DSN_APP_DATE: --/--/--; CHK_APP_DATE: --/--/--
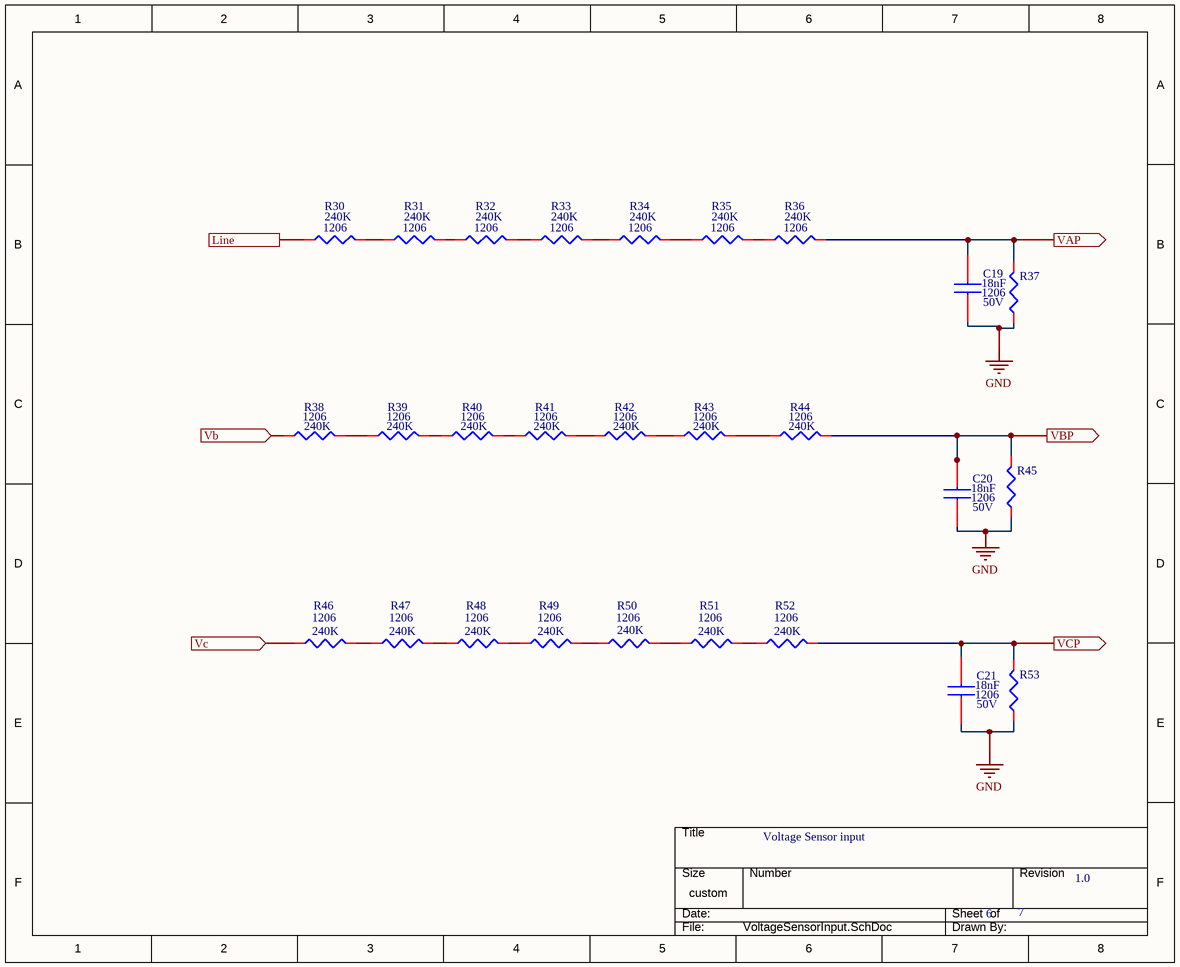
[diagram p5: VoltageSensorInput.SchDoc]

### Parts
C19  Size: 1206  Capacitance: 18nF  Voltage: 50V  [CAPC3316X180N]  (hidden comment: C1206C183J5RACTU)
C20  Size: 1206  Capacitance: 18nF  Voltage: 50V  [CAPC3316X180N]  (hidden comment: C1206C183J5RACTU)
C21  Size: 1206  Capacitance: 18nF  Voltage: 50V  [CAPC3316X180N]  (hidden comment: C1206C183J5RACTU)
R30  Size: 1206  Resistance: 240K  [RESC3216X70N]  (hidden comment: ERA-8AEB244V)
R31  Size: 1206  Resistance: 240K  [RESC3216X70N]  (hidden comment: ERA-8AEB244V)
R32  Size: 1206  Resistance: 240K  [RESC3216X70N]  (hidden comment: ERA-8AEB244V)
R33  Size: 1206  Resistance: 240K  [RESC3216X70N]  (hidden comment: ERA-8AEB244V)
R34  Size: 1206  Resistance: 240K  [RESC3216X70N]  (hidden comment: ERA-8AEB244V)
R35  Size: 1206  Resistance: 240K  [RESC3216X70N]  (hidden comment: ERA-8AEB244V)
R36  Size: 1206  Resistance: 240K  [RESC3216X70N]  (hidden comment: ERA-8AEB244V)
R37  ERA-6AED102V  [RESC2013X84N]  (value not drawn)
R38  Size: 1206  Resistance: 240K  [RESC3216X70N]  (hidden comment: ERA-8AEB244V)
R39  Size: 1206  Resistance: 240K  [RESC3216X70N]  (hidden comment: ERA-8AEB244V)
R40  Size: 1206  Resistance: 240K  [RESC3216X70N]  (hidden comment: ERA-8AEB244V)
R41  Size: 1206  Resistance: 240K  [RESC3216X70N]  (hidden comment: ERA-8AEB244V)
R42  Size: 1206  Resistance: 240K  [RESC3216X70N]  (hidden comment: ERA-8AEB244V)
R43  Size: 1206  Resistance: 240K  [RESC3216X70N]  (hidden comment: ERA-8AEB244V)
R44  Size: 1206  Resistance: 240K  [RESC3216X70N]  (hidden comment: ERA-8AEB244V)
R45  ERA-6AED102V  [RESC2013X84N]  (value not drawn)
R46  Size: 1206  Resistance: 240K  [RESC3216X70N]  (hidden comment: ERA-8AEB244V)
R47  Size: 1206  Resistance: 240K  [RESC3216X70N]  (hidden comment: ERA-8AEB244V)
R48  Size: 1206  Resistance: 240K  [RESC3216X70N]  (hidden comment: ERA-8AEB244V)
R49  Size: 1206  Resistance: 240K  [RESC3216X70N]  (hidden comment: ERA-8AEB244V)
R50  Size: 1206  Resistance: 240K  [RESC3216X70N]  (hidden comment: ERA-8AEB244V)
R51  Size: 1206  Resistance: 240K  [RESC3216X70N]  (hidden comment: ERA-8AEB244V)
R52  Size: 1206  Resistance: 240K  [RESC3216X70N]  (hidden comment: ERA-8AEB244V)
R53  ERA-6AED102V  [RESC2013X84N]  (value not drawn)

### Ports
Line (see Main[3B], PowerSupply[4C], VoltageIn[4E]), VAP (out, see Main[3B], MeteringIC[5C]), Vb (in, see Main[3B], VoltageIn[4C]), VBP (out, see Main[3B], MeteringIC[5C]), Vc (in, see Main[3B], VoltageIn[4C]), VCP (out, see Main[3B], MeteringIC[5D])

### Nets
GND: C19.2 C20.2 C21.2 R37.2 R45.2 R53.2
Va: R30.2 ; port Line
Vb: R38.2 ; port Vb
Vc: R46.2 ; port Vc
NetC19_1: C19.1 R36.1 R37.1 ; port VAP
NetC20_1: C20.1 R44.1 R45.1 ; port VBP
NetC21_1: C21.1 R52.1 R53.1 ; port VCP
NetR30_1: R30.1 R31.2
NetR31_1: R31.1 R32.2
NetR32_1: R32.1 R33.2
NetR33_1: R33.1 R34.2
NetR34_1: R34.1 R35.2
NetR35_1: R35.1 R36.2
NetR38_1: R38.1 R39.2
NetR39_1: R39.1 R40.2
NetR40_1: R40.1 R41.2
NetR41_1: R41.1 R42.2
NetR42_1: R42.1 R43.2
NetR43_1: R43.1 R44.2
NetR46_1: R46.1 R47.2
NetR47_1: R47.1 R48.2
NetR48_1: R48.1 R49.2
NetR49_1: R49.1 R50.2
NetR50_1: R50.1 R51.2
NetR51_1: R51.1 R52.2

### Notes on the sheet
- Voltage Sensor input
- 6
- 7
- 1.0
- DWG. NO.
- REV.
- SHT.
- THIS DOCUMENT AND THE DATA DISCLOSED HEREIN OR HEREWITH IS THE PROPERTY OF ALTIUM LIMITED AND MAY BE FREELY DISTRIBUTED IN WHOLE. NO RIGHTS ARE RESERVED OR EXPRESS OR IMPLIED WARANTEE GIVEN.
- REVISION
- DESCRIPTION
- DATE
- APPROVED
- ENG:
- APPROVALS
- PROJECT
- DSN:
- CHK:
- REFERENCE DOCUMENTS
- PROJECT REVISION:
- TITLE
- DOCUMENT REVISION:
- DESIGN ITEM:
- BOM:
- FAB DWG:
- PCB DWG:
- ASSY DWG:
- SCALE:
- SIZE
- B
- CAGE CODE
- FILE NAME
- DWG NO.
- SHEET
- OF
- REV

### Library data of the parts
C19-C21 = C1206X224KARACAUTO: as C11 on sheet CurrentSensorInput; Mouser Part Number: 80-C1206X224KARAUTO; Mouser Price/Stock: https://www.mouser.co.uk/ProductDetail/KEMET/C1206X224KARACAUTO?qs=zW32dvEIR3ul9TqTUrs40g%3D%3D; Manufacturer_Part_Number: C1206X224KARACAUTO; Datasheet Link: https://search.kemet.com/component-documentation/download/specsheet/C1206X224KARACAUTO
R30-R36 R38-R44 R46-R52 = ERA-8AEB244V: Thin Film Resistors - SMD 1206 240Kohm 0.1% 25ppm; Manufacturer_Name: Panasonic; Geometry.Height: 0.7mm; Mouser Part Number: 667-ERA-8AEB244V; Mouser Price/Stock: https://www.mouser.com/Search/Refine.aspx?Keyword=667-ERA-8AEB244V; Manufacturer_Part_Number: ERA-8AEB244V; Datasheet Link: https://componentsearchengine.com/Datasheets/1/ERA-8AEB244V.pdf
R37 R45 R53 = ERA-6AED102V: as R7 on sheet CurrentSensorInput; Mouser Part Number: 667-ERA-6AED102V; Mouser Price/Stock: https://www.mouser.co.uk/ProductDetail/Panasonic/ERA-6AED102V?qs=MNPzkKEzRtTAvKH%252BuMqwyg%3D%3D; Manufacturer_Part_Number: ERA-6AED102V; Datasheet Link: https://industrial.panasonic.com/cdbs/www-data/pdf/RDM0000/AOA0000C307.pdf

## Sheet MeteringIC.SchDoc
size 299 x 240 mm; SheetNumber: 4; SheetTotal: 7; ENG_APP_DATE: --/--/--; DSN_APP_DATE: --/--/--; CHK_APP_DATE: --/--/--
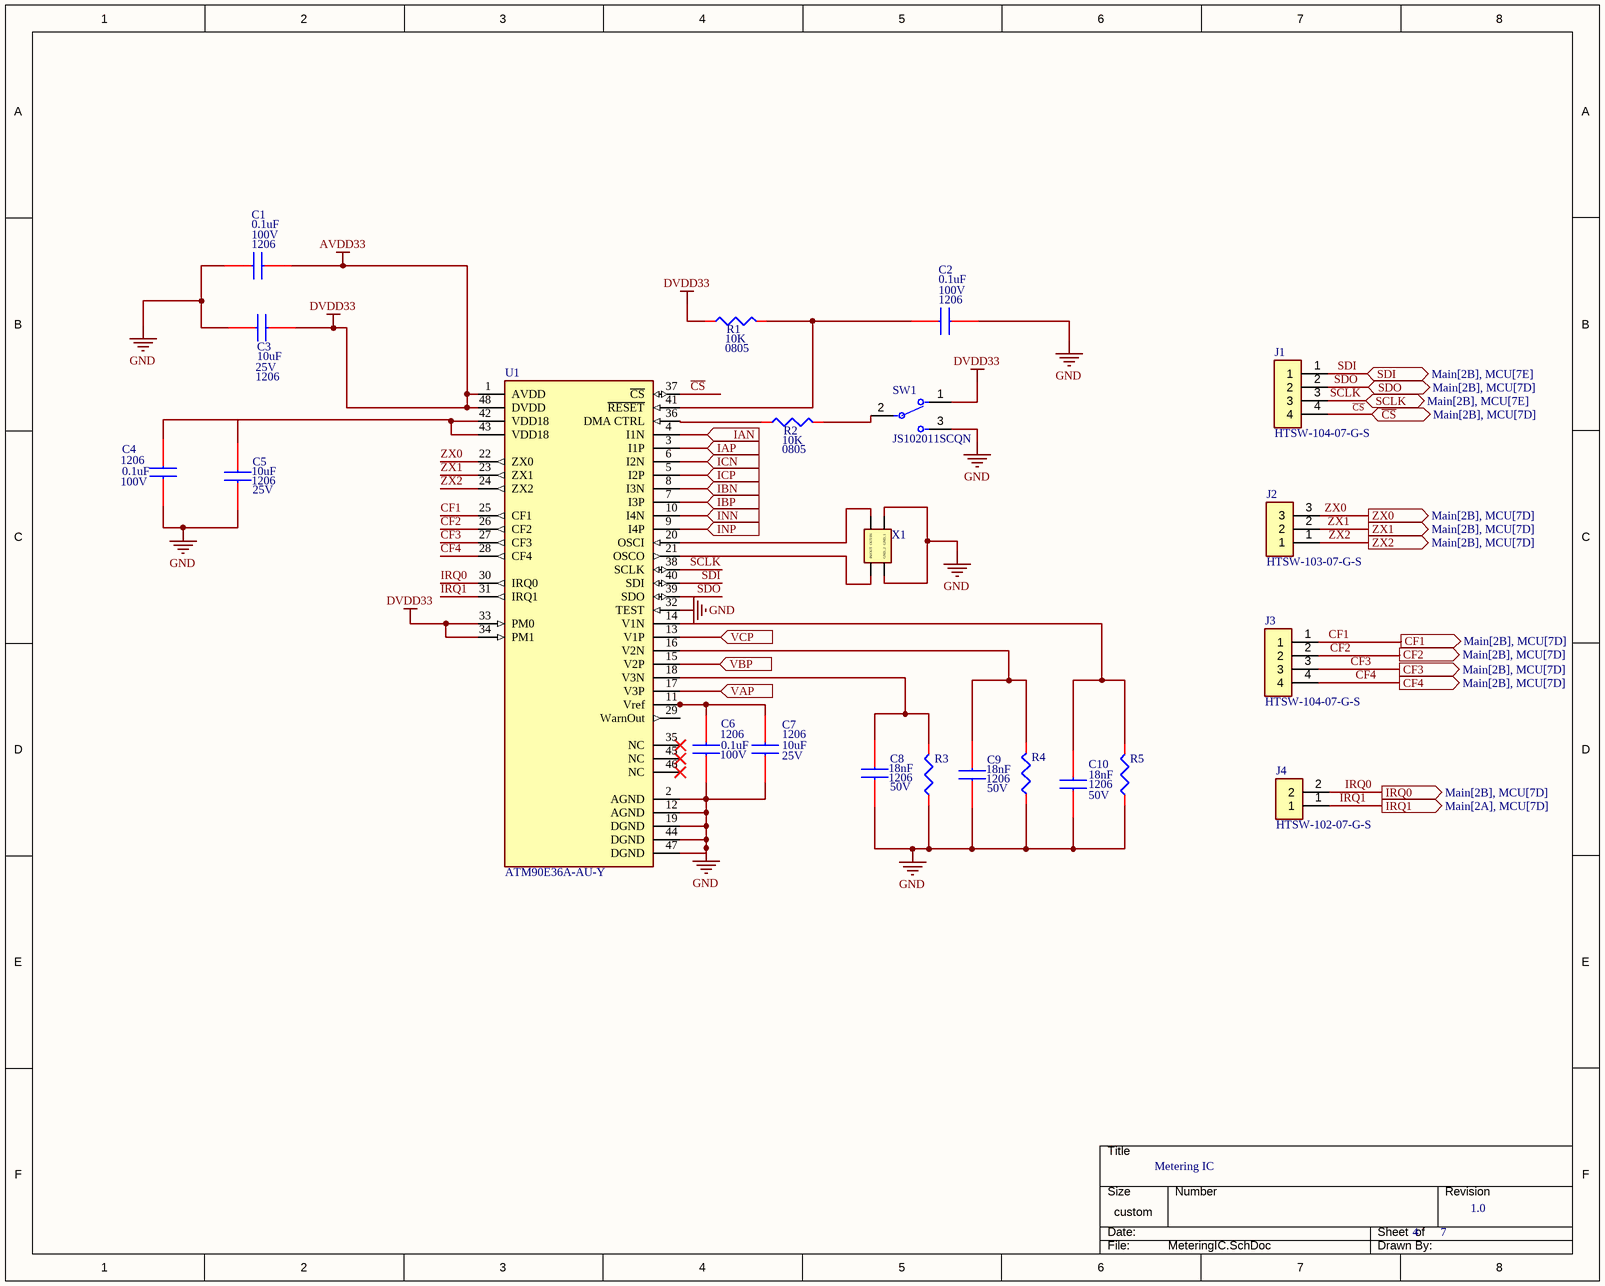
[diagram p6: MeteringIC.SchDoc]

### Parts
C1  Size: 1206  Capacitance: 0.1uF  Voltage: 100V  [CAPC3316X180N]  (hidden comment: C1206C104J1RACAUTO)
C2  Size: 1206  Capacitance: 0.1uF  Voltage: 100V  [CAPC3316X180N]  (hidden comment: C1206C104J1RACAUTO)
C3  Size: 1206  Capacitance: 10uF  Voltage: 25V  [CAPC3316X180N]  (hidden comment: MBAST31LAB7106KTNA01)
C4  Size: 1206  Capacitance: 0.1uF  Voltage: 100V  [CAPC3316X180N]  (hidden comment: C1206C104J1RACAUTO)
C5  Size: 1206  Capacitance: 10uF  Voltage: 25V  [CAPC3316X180N]  (hidden comment: MBAST31LAB7106KTNA01)
C6  Size: 1206  Capacitance: 0.1uF  Voltage: 100V  [CAPC3316X180N]  (hidden comment: C1206C104J1RACAUTO)
C7  Size: 1206  Capacitance: 10uF  Voltage: 25V  [CAPC3316X180N]  (hidden comment: MBAST31LAB7106KTNA01)
C8  Size: 1206  Capacitance: 18nF  Voltage: 50V  [CAPC3316X180N]  (hidden comment: C1206C183J5RACTU)
C9  Size: 1206  Capacitance: 18nF  Voltage: 50V  [CAPC3316X180N]  (hidden comment: C1206C183J5RACTU)
C10  Size: 1206  Capacitance: 18nF  Voltage: 50V  [CAPC3316X180N]  (hidden comment: C1206C183J5RACTU)
J1  HTSW-104-07-G-S  [HDRV4W64P0X254_1X4_1016X248X838P]
J2  HTSW-103-07-G-S  [HDRV3W64P0X254_1X3_749X249X858P]
J3  HTSW-104-07-G-S  [HDRV4W64P0X254_1X4_1016X248X838P]
J4  HTSW-102-07-G-S  [HDRV2W64P0X254_1X2_508X248X838P]
R1  Resistance: 10K  Size: 0805  [RESC2013X84N]  (hidden comment: CRCW201010K0JNEFIF)
R2  Resistance: 10K  Size: 0805  [RESC2013X84N]  (hidden comment: CRCW201010K0JNEFIF)
R3  ERA-6AED102V  [RESC2013X84N]  (value not drawn)
R4  ERA-6AED102V  [RESC2013X84N]  (value not drawn)
R5  ERA-6AED102V  [RESC2013X84N]  (value not drawn)
SW1  JS102011SCQN  [FP-JS102011SCQN-MFG]
U1  ATM90E36A-AU-Y  [FP-ATM90E36A-AU-Y-MFG]
X1  ECS-163.84-10-30B-CKM-TR  [ECS163841030BCKMTR]  (value not drawn)

### Ports
CF1 (out, see Main[2B], MCU[7D]), CF2 (out, see Main[2B], MCU[7D]), CF3 (out, see Main[2B], MCU[7D]), CF4 (out, see Main[2B], MCU[7D]), IAN (in, see Main[2C]), IAP (in, see Main[2C]), IBN (in, see Main[2C]), IBP (in, see Main[2C]), ICN (in, see Main[2C], CurrentSensorInput[5B]), ICP (in, see Main[2C], CurrentSensorInput[5C]), INN (in, see Main[2C], CurrentSensorInput[6E]), INP (in, see Main[2C], CurrentSensorInput[6D]), IRQ0 (out, see Main[2B], MCU[7D]), IRQ1 (out, see Main[2A], MCU[7D]), SCLK (bidir, see Main[2B], MCU[7E]), SDI (bidir, see Main[2B], MCU[7E]), SDO (bidir, see Main[2B], MCU[7D]), VAP (in, see Main[2B], VoltageSensorInput[1E]), VBP (in, see Main[2B], VoltageSensorInput[1D]), VCP (in, see Main[2B], VoltageSensorInput[1B]), ZX0 (out, see Main[2B], MCU[7D]), ZX1 (out, see Main[2B], MCU[7D]), ZX2 (out, see Main[2B], MCU[7D]), ~{CS} (bidir, see Main[2B], MCU[7D])

### Nets
AVDD33: C1.1 C3.1 R1.2 SW1.1 U1.1(AVDD) U1.33(PM0) U1.34(PM1) U1.48(DVDD)  [also labelled DVDD33]
GND: C1.2 C2.1 C3.2 C4.2 C5.2 C6.2 C7.2 C8.2 C9.2 C10.2 R3.2 R4.2 R5.2 SW1.3 U1.2(AGND) U1.12(AGND) U1.19(DGND) U1.32(TEST) U1.44(DGND) U1.47(DGND) X1.2(GND_1) X1.4(GND_2)
~{CS}: J1.4 U1.37(~{CS}) ; port ~{CS}
CF1: J3.1 U1.25(CF1) ; port CF1
CF2: J3.2 U1.26(CF2) ; port CF2
CF3: J3.3 U1.27(CF3) ; port CF3
CF4: J3.4 U1.28(CF4) ; port CF4
IRQ0: J4.2 U1.30(IRQ0) ; port IRQ0
IRQ1: J4.1 U1.31(IRQ1) ; port IRQ1
SCLK: J1.3 U1.38(SCLK) ; port SCLK
SDI: J1.1 U1.40(SDI) ; port SDI
SDO: J1.2 U1.39(SDO) ; port SDO
ZX0: J2.3 U1.22(ZX0) ; port ZX0
ZX1: J2.2 U1.23(ZX1) ; port ZX1
ZX2: J2.1 U1.24(ZX2) ; port ZX2
NetC2_2: C2.2 R1.1 U1.41(~{RESET})
NetC4_1: C4.1 C5.1 U1.42(VDD18) U1.43(VDD18)
NetC6_1: C6.1 C7.1 U1.11(Vref)
NetC8_1: C8.1 R3.1 U1.18(V3N)
NetC9_1: C9.1 R4.1 U1.16(V2N)
NetC10_1: C10.1 R5.1 U1.14(V1N)
NetC11_1: U1.10(I4N) ; port INN
NetC12_1: U1.8(I3N) ; port IBN
NetC13_2: U1.7(I3P) ; port IBP
NetC14_2: U1.9(I4P) ; port INP
NetC15_1: U1.5(I2P) ; port ICP
NetC16_1: U1.3(I1P) ; port IAP
NetC17_2: U1.6(I2N) ; port ICN
NetC18_2: U1.4(I1N) ; port IAN
NetC19_1: U1.17(V3P) ; port VAP
NetC20_1: U1.15(V2P) ; port VBP
NetC21_1: U1.13(V1P) ; port VCP
NetR2_1: R2.1 SW1.2(C)
NetR2_2: R2.2 U1.36(DMA_CTRL)
NetU1_20: U1.20(OSCI) X1.3(OUT/IN)
NetU1_21: U1.21(OSCO) X1.1(IN/OUT)

Not connected (* = marked no-connect by the designer): U1 29(WarnOut) 35(NC)* 45(NC)* 46(NC)*

### Notes on the sheet
- Metering IC
- 4
- 7
- 1.0
- DWG. NO.
- REV.
- SHT.
- THIS DOCUMENT AND THE DATA DISCLOSED HEREIN OR HEREWITH IS THE PROPERTY OF ALTIUM LIMITED AND MAY BE FREELY DISTRIBUTED IN WHOLE. NO RIGHTS ARE RESERVED OR EXPRESS OR IMPLIED WARANTEE GIVEN.
- REVISION
- DESCRIPTION
- DATE
- APPROVED
- ENG:
- APPROVALS
- PROJECT
- DSN:
- CHK:
- REFERENCE DOCUMENTS
- PROJECT REVISION:
- TITLE
- DOCUMENT REVISION:
- DESIGN ITEM:
- BOM:
- FAB DWG:
- PCB DWG:
- ASSY DWG:
- SCALE:
- SIZE
- B
- CAGE CODE
- FILE NAME
- DWG NO.
- SHEET
- OF
- REV

### Library data of the parts
C1 C2 C4 C6 = C1206X224KARACAUTO: as C27 on sheet MCU; Mouser Part Number: 80-C1206X224KARAUTO; Mouser Price/Stock: https://www.mouser.co.uk/ProductDetail/KEMET/C1206X224KARACAUTO?qs=zW32dvEIR3ul9TqTUrs40g%3D%3D; Manufacturer_Part_Number: C1206X224KARACAUTO; Datasheet Link: https://search.kemet.com/component-documentation/download/specsheet/C1206X224KARACAUTO
C3 C5 C7 = C1206X224KARACAUTO: as C29 on sheet MCU; Mouser Part Number: 80-C1206X224KARAUTO; Mouser Price/Stock: https://www.mouser.co.uk/ProductDetail/KEMET/C1206X224KARACAUTO?qs=zW32dvEIR3ul9TqTUrs40g%3D%3D; Manufacturer_Part_Number: C1206X224KARACAUTO; Datasheet Link: https://search.kemet.com/component-documentation/download/specsheet/C1206X224KARACAUTO
C8-C10 = C1206X224KARACAUTO: as C11 on sheet CurrentSensorInput; Mouser Part Number: 80-C1206X224KARAUTO; Mouser Price/Stock: https://www.mouser.co.uk/ProductDetail/KEMET/C1206X224KARACAUTO?qs=zW32dvEIR3ul9TqTUrs40g%3D%3D; Manufacturer_Part_Number: C1206X224KARACAUTO; Datasheet Link: https://search.kemet.com/component-documentation/download/specsheet/C1206X224KARACAUTO
J1 J3 = HTSW-104-07-G-S: SAMTEC - HTSW-104-07-G-S - , , 2.54 mm, 4 , , HTSW Series, , 1; Geometry.Height: 8.38mm; Mouser Part Number: 200-HTSW10407GS; Mouser Price/Stock: https://www.mouser.co.uk/ProductDetail/Samtec/HTSW-104-07-G-S?qs=0lQeLiL1qyYqiS2uxGtRCQ%3D%3D; Manufacturer_Name: SAMTEC; Manufacturer_Part_Number: HTSW-104-07-G-S; Datasheet Link: https://componentsearchengine.com/Datasheets/2/HTSW-104-07-G-S.pdf
J2 = HTSW-103-07-G-S: as J5 on sheet PowerSupply; Mouser Part Number: 200-HTSW10307GS; Mouser Price/Stock: https://www.mouser.co.uk/ProductDetail/Samtec/HTSW-103-07-G-S?qs=0lQeLiL1qyYZ%252B%2F6nDbu9tg%3D%3D; Manufacturer_Name: SAMTEC; Manufacturer_Part_Number: HTSW-103-07-G-S; Datasheet Link: http://suddendocs.samtec.com/prints/htsw-xxx-xx-xxx-x-xx-xx-xx-mkt.pdf
J4 = HTSW-102-07-G-S: as J9 on sheet MCU; Mouser Part Number: 200-HTSW10207GS; Mouser Price/Stock: https://www.mouser.co.uk/ProductDetail/Samtec/HTSW-102-07-G-S?qs=FESYatJ8odI1BCBanfu%2FIg%3D%3D; Manufacturer_Name: SAMTEC; Manufacturer_Part_Number: HTSW-102-07-G-S; Datasheet Link: http://suddendocs.samtec.com/prints/htsw-xxx-xx-xxx-x-xx-xx-xx-mkt.pdf
R1 R2 = WSL080500000ZEA9: as R55 on sheet PowerSupply; Mouser Part Number: 71-WSL080500000ZEA9; Mouser Price/Stock: https://www.mouser.co.uk/ProductDetail/Vishay-Dale/WSL080500000ZEA9?qs=f1l5vAGoKgsImKS87N8TmQ%3D%3D; Manufacturer_Name: Vishay; Manufacturer_Part_Number: WSL080500000ZEA9; Datasheet Link: https://ad.componentsearchengine.com/Datasheets/2/WSL080500000ZEA9.pdf
R3-R5 = ERA-6AED102V: as R7 on sheet CurrentSensorInput; Mouser Part Number: 667-ERA-6AED102V; Mouser Price/Stock: https://www.mouser.co.uk/ProductDetail/Panasonic/ERA-6AED102V?qs=MNPzkKEzRtTAvKH%252BuMqwyg%3D%3D; Manufacturer_Part_Number: ERA-6AED102V; Datasheet Link: https://industrial.panasonic.com/cdbs/www-data/pdf/RDM0000/AOA0000C307.pdf
SW1 = CMP-10038-000023-1: SWITCH SLIDE SPDT 300MA 6V; Electrical Life: 5000Cycles; Actuator Type: Standard; Contact Resistance: 70mR; Actuator Material: Nylon; Max Voltage Rating (DC): 30V; Actuator Length: 2mm; Switch Function: On-On; Actuator Color: Black; Radiation Hardening: No; Throw Configuration: SPDT; Depth: 7.5mm; Case/Package: SMD/SMT; Package Quantity: 4000; Min Operating Temperature: -40°C; Length: 8.5mm; Current Rating: 300mA; Mount: Surface Mount; Voltage Rating (DC): 6V; RoHS Compliant: Yes; Orientation: Straight; Housing Material: Nylon; Contact Plating: Silver; Max Operating Temperature: 85°C; Packaging: Tape and Reel; Switch Travel: 2mm; Max Current Rating: 300mA; Contact Material: Copper Alloy; Series: JS; Termination: Gull Wing
U1 = CMP-06317-000017-1: 48-TQFP, IND TEMP, 1.8V/3V, TRAY; RoHS Compliant: Yes
X1 = ECS-163.84-10-30B-CKM-TR: Crystals 16.384MHz 10ppm 10pF -20C +70C; Manufacturer_Name: ECS; Geometry.Height: 0.85mm; Mouser Part Number: 520-163.84-1030BCKMT; Mouser Price/Stock: https://www.mouser.com/Search/Refine.aspx?Keyword=520-163.84-1030BCKMT; Manufacturer_Part_Number: ECS-163.84-10-30B-CKM-TR; Datasheet Link: https://componentsearchengine.com/Datasheets/1/ECS-163.84-10-30B-CKM-TR.pdf

## Nets that join several sheets
+5V: PowerSupply (5 pins), MCU (J10.1)
AVDD33: PowerSupply (C26.1 J5.2), MCU (5 pins), MeteringIC (8 pins)
GND: PowerSupply (10 pins), CurrentSensorInput (16 pins), MCU (34 pins), VoltageSensorInput (6 pins), MeteringIC (22 pins)
~{CS}: MCU (U4.11), MeteringIC (J1.4 U1.37)
CF1: MCU (U4.15), MeteringIC (J3.1 U1.25)
CF2: MCU (U4.16), MeteringIC (J3.2 U1.26)
CF3: MCU (U4.17), MeteringIC (J3.3 U1.27)
CF4: MCU (U4.18), MeteringIC (J3.4 U1.28)
IRQ0: MCU (U4.19), MeteringIC (J4.2 U1.30)
IRQ1: MCU (U4.20), MeteringIC (J4.1 U1.31)
NetC11_1: CurrentSensorInput (C11.1 R9.1), MeteringIC (U1.10)
NetC12_1: CurrentSensorInput (C12.1 R7.1), MeteringIC (U1.8)
NetC13_2: CurrentSensorInput (C13.2 R15.1), MeteringIC (U1.7)
NetC14_2: CurrentSensorInput (C14.2 R17.1), MeteringIC (U1.9)
NetC15_1: CurrentSensorInput (C15.1 R21.1), MeteringIC (U1.5)
NetC16_1: CurrentSensorInput (C16.1 R19.2), MeteringIC (U1.3)
NetC17_2: CurrentSensorInput (C17.2 R27.1), MeteringIC (U1.6)
NetC18_2: CurrentSensorInput (C18.2 R29.2), MeteringIC (U1.4)
NetC19_1: VoltageSensorInput (C19.1 R36.1 R37.1), MeteringIC (U1.17)
NetC20_1: VoltageSensorInput (C20.1 R44.1 R45.1), MeteringIC (U1.15)
NetC21_1: VoltageSensorInput (C21.1 R52.1 R53.1), MeteringIC (U1.13)
SCLK: MCU (U4.8), MeteringIC (J1.3 U1.38)
SDI: MCU (U4.9), MeteringIC (J1.1 U1.40)
SDO: MCU (U4.10), MeteringIC (J1.2 U1.39)
Va: VoltageIn (J6.2), PowerSupply (F1.1), VoltageSensorInput (R30.2)
Vb: VoltageIn (J7.2), VoltageSensorInput (R38.2)
Vc: VoltageIn (J7.1), VoltageSensorInput (R46.2)
Vn: VoltageIn (J6.1), PowerSupply (B1.1 C22.1 U3.2)
ZX0: MCU (U4.12), MeteringIC (J2.3 U1.22)
ZX1: MCU (U4.13), MeteringIC (J2.2 U1.23)
ZX2: MCU (U4.14), MeteringIC (J2.1 U1.24)